# Altium project magArraySensor.PrjPcb
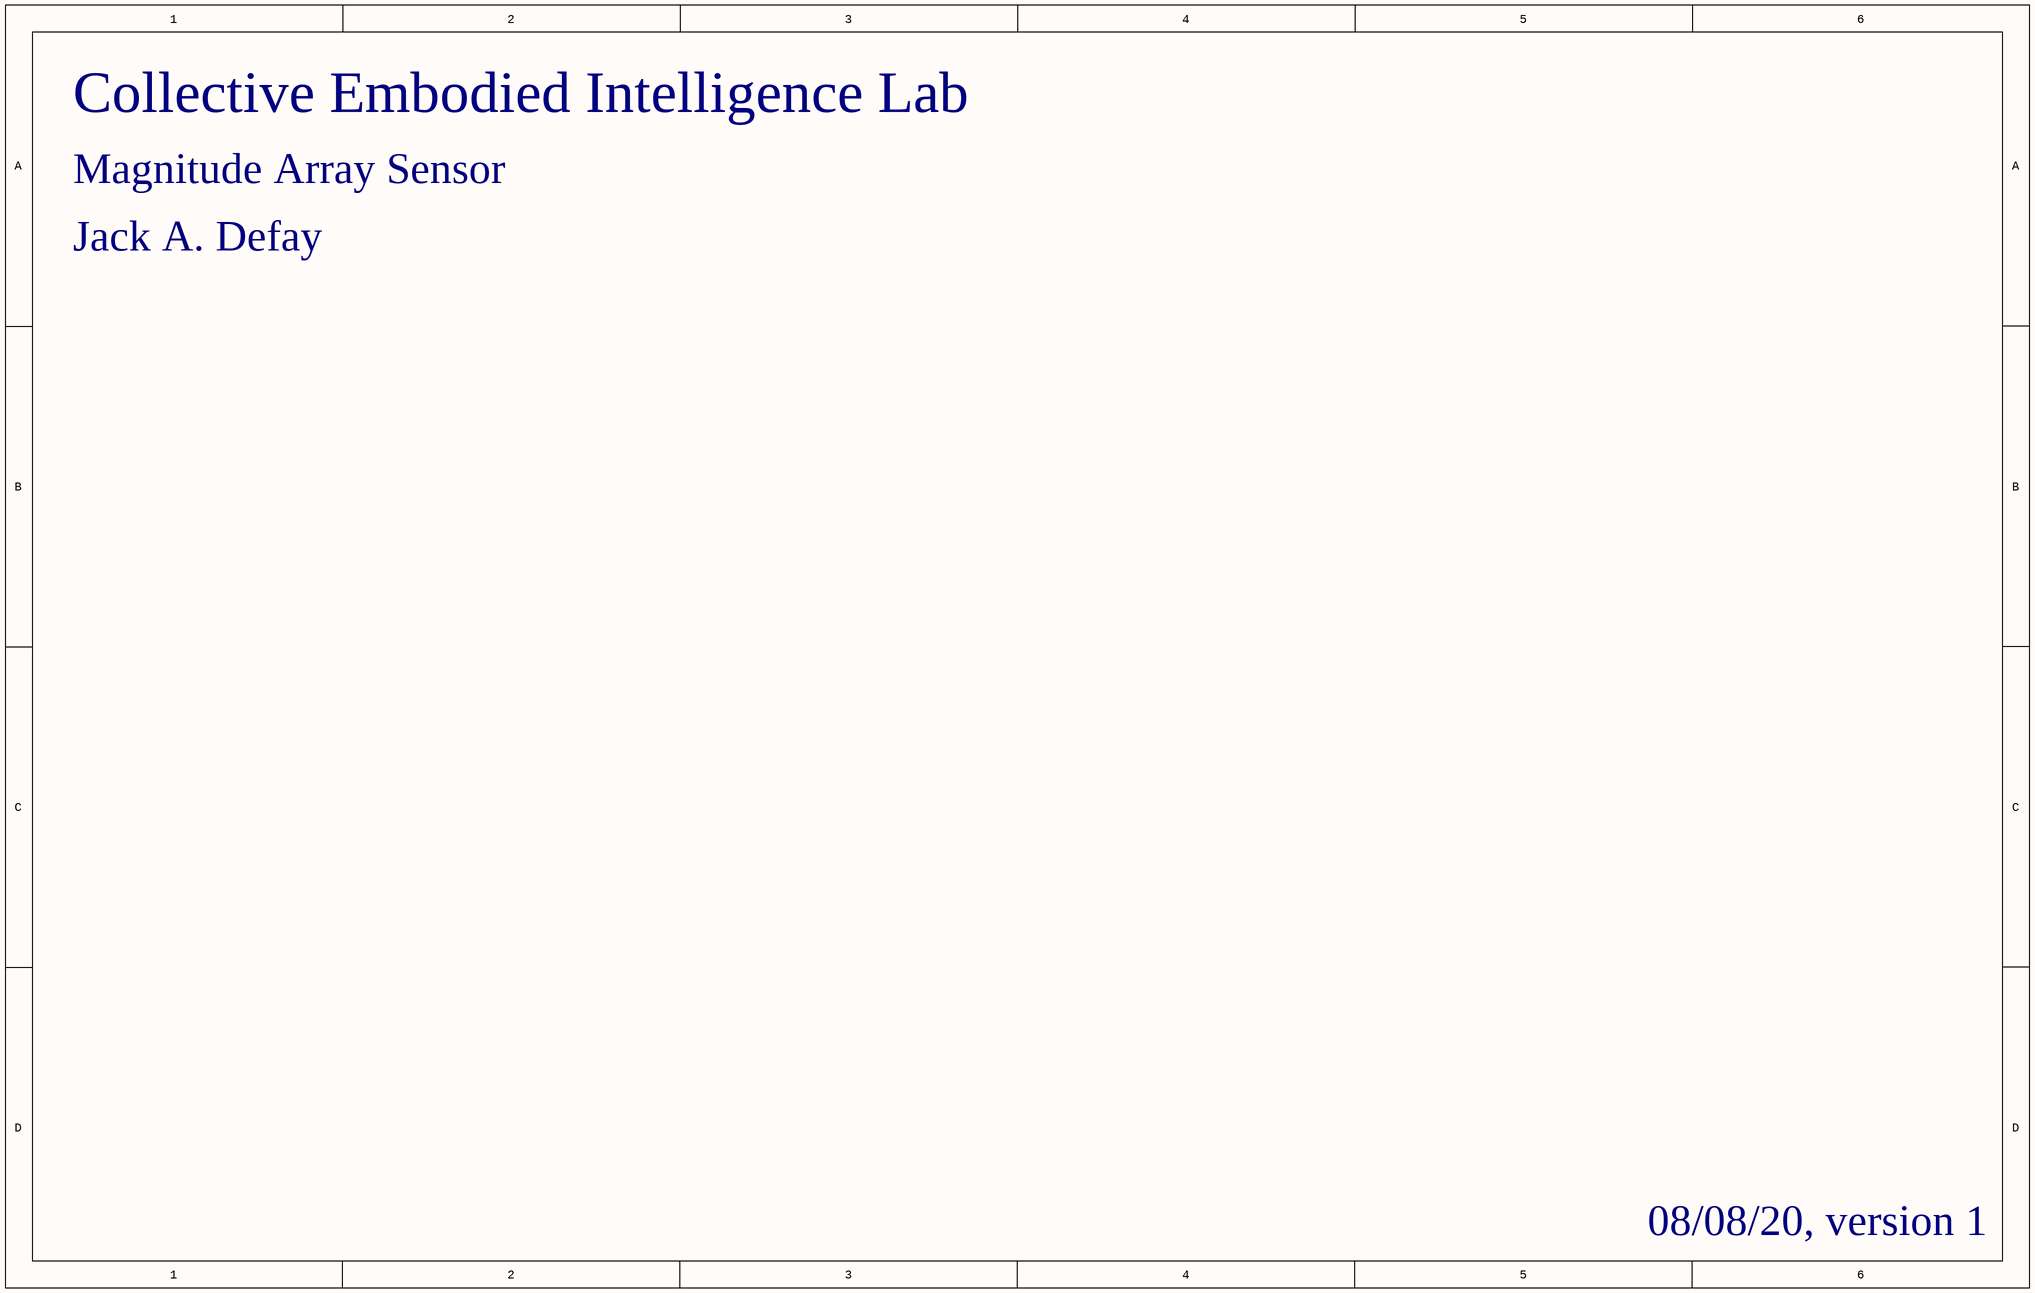
[diagram p0: [01]-Title Page.SchDoc]
3 sheets, 28 parts. Net scope: global (net labels, ports and power ports of the same name join across sheets).
Board file: magArraySensor.PcbDoc
Sheets:
  [01]-Title Page.SchDoc
  [02]-Thermistors.SchDoc
  [04]-Connector.SchDoc

## Sheet [01]-Title Page.SchDoc: ENTER SHEET TITLE
size B; Engineer: ENTER ENGINEER NAME; Organization: CUAir; Address1: L3, 12a Rodborough Rd; Address2: Frenchs Forest; Address3: NSW; Address4: Australia 2086; Revision: ENTER REVISION NUMBER; CompetitionYear: 2019; CPN: ENTER CPN; PROJECT: ENTER PROJECT NAME

### Notes on the sheet
- Collective Embodied Intelligence Lab
- Magnitude Array Sensor
- Jack A. Defay
- 08/08/20, version 1
- Cornell University Unmanned Air Systems
- PROJECT:
- ID:
- ENGINEER
- REVISION
- Project
- Title
- Size:
- Date:
- B
- Number:
- Revision:
- File:

## Sheet [02]-Thermistors.SchDoc: ENTER SHEET TITLE
size B; Engineer: ENTER ENGINEER NAME; Organization: CUAir; Address1: L3, 12a Rodborough Rd; Address2: Frenchs Forest; Address3: NSW; Address4: Australia 2086; Revision: ENTER REVISION NUMBER; CompetitionYear: 2019; CPN: ENTER CPN; PROJECT: ENTER PROJECT NAME
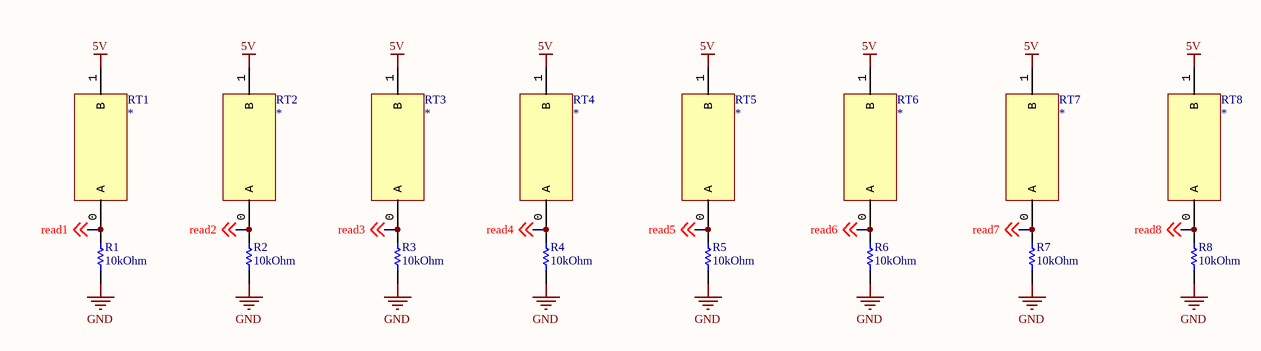
[diagram p1: [02]-Thermistors.SchDoc]

### Parts
R1  10kOhm  [RESC2013X60X35LL10T20]
R2  10kOhm  [RESC2013X60X35LL10T20]
R3  10kOhm  [RESC2013X60X35LL10T20]
R4  10kOhm  [RESC2013X60X35LL10T20]
R5  10kOhm  [RESC2013X60X35LL10T20]
R6  10kOhm  [RESC2013X60X35LL10T20]
R7  10kOhm  [RESC2013X60X35LL10T20]
R8  10kOhm  [RESC2013X60X35LL10T20]
RT1  *  [thermistor]
RT2  *  [thermistor]
RT3  *  [thermistor]
RT4  *  [thermistor]
RT5  *  [thermistor]
RT6  *  [thermistor]
RT7  *  [thermistor]
RT8  *  [thermistor]

### Nets
5V: RT1.1(B) RT2.1(B) RT3.1(B) RT4.1(B) RT5.1(B) RT6.1(B) RT7.1(B) RT8.1(B)
GND: R1.1 R2.1 R3.1 R4.1 R5.1 R6.1 R7.1 R8.1
read1: R1.2 RT1.0(A) ; off-sheet read1
read2: R2.2 RT2.0(A) ; off-sheet read2
read3: R3.2 RT3.0(A) ; off-sheet read3
read4: R4.2 RT4.0(A) ; off-sheet read4
read5: R5.2 RT5.0(A) ; off-sheet read5
read6: R6.2 RT6.0(A) ; off-sheet read6
read7: R7.2 RT7.0(A) ; off-sheet read7
read8: R8.2 RT8.0(A) ; off-sheet read8

### Notes on the sheet
- Project
- Title
- Size:
- Date:
- B
- Number:
- Revision:
- File:

### Library data of the parts
R1-R8 = CMP-1659-00013-2: RES 10.0K OHM 1/8W 1% 0805 SMD; MPN: RC0805FR-0710KL; Manufacturer: Yageo; PackageReference: 0805; ComponentLink1URL: http://www.yageo.com/documents/recent/PYu-RC_Group_51_RoHS_L_04.pdf; ComponentLink1Description: Datasheet; Value: 10kOhm
RT1-RT8 = thermistor: MPN: *; Manufacturer: *; Value: *

## Sheet [04]-Connector.SchDoc: ENTER SHEET TITLE
size B; Engineer: ENTER ENGINEER NAME; Organization: CUAir; Address1: L3, 12a Rodborough Rd; Address2: Frenchs Forest; Address3: NSW; Address4: Australia 2086; Revision: ENTER REVISION NUMBER; CompetitionYear: 2019; CPN: ENTER CPN; PROJECT: ENTER PROJECT NAME
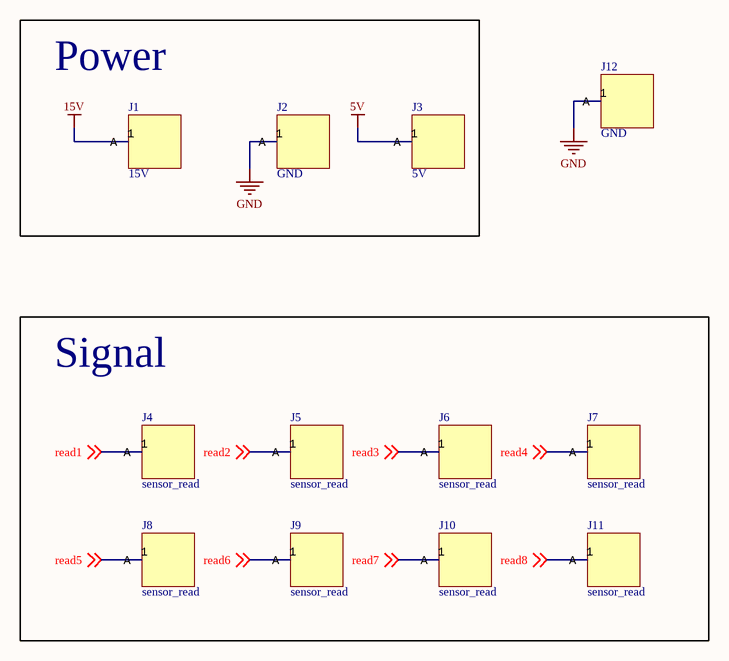
[diagram p2: [04]-Connector.SchDoc]

### Parts
J1  15V  [PIN]
J2  GND  [PIN]
J3  5V  [PIN]
J4  sensor_read  [PIN]
J5  sensor_read  [PIN]
J6  sensor_read  [PIN]
J7  sensor_read  [PIN]
J8  sensor_read  [PIN]
J9  sensor_read  [PIN]
J10  sensor_read  [PIN]
J11  sensor_read  [PIN]
J12  GND  [PIN]

### Blocks framed on the sheet
Power: J1-J3
Signal: J4-J11

### Nets
5V: J3.1(A)
15V: J1.1(A)
GND: J2.1(A) J12.1(A)
read1: J4.1(A) ; off-sheet read1
read2: J5.1(A) ; off-sheet read2
read3: J6.1(A) ; off-sheet read3
read4: J7.1(A) ; off-sheet read4
read5: J8.1(A) ; off-sheet read5
read6: J9.1(A) ; off-sheet read6
read7: J10.1(A) ; off-sheet read7
read8: J11.1(A) ; off-sheet read8

### Notes on the sheet
- Project
- Title
- Size:
- Date:
- B
- Number:
- Revision:
- File:

### Library data of the parts
J3 = 15V

## Nets that join several sheets
5V: [02]-Thermistors (8 pins), [04]-Connector (J3.1)
GND: [02]-Thermistors (8 pins), [04]-Connector (J2.1 J12.1)
read1: [02]-Thermistors (R1.2 RT1.0), [04]-Connector (J4.1)
read2: [02]-Thermistors (R2.2 RT2.0), [04]-Connector (J5.1)
read3: [02]-Thermistors (R3.2 RT3.0), [04]-Connector (J6.1)
read4: [02]-Thermistors (R4.2 RT4.0), [04]-Connector (J7.1)
read5: [02]-Thermistors (R5.2 RT5.0), [04]-Connector (J8.1)
read6: [02]-Thermistors (R6.2 RT6.0), [04]-Connector (J9.1)
read7: [02]-Thermistors (R7.2 RT7.0), [04]-Connector (J10.1)
read8: [02]-Thermistors (R8.2 RT8.0), [04]-Connector (J11.1)